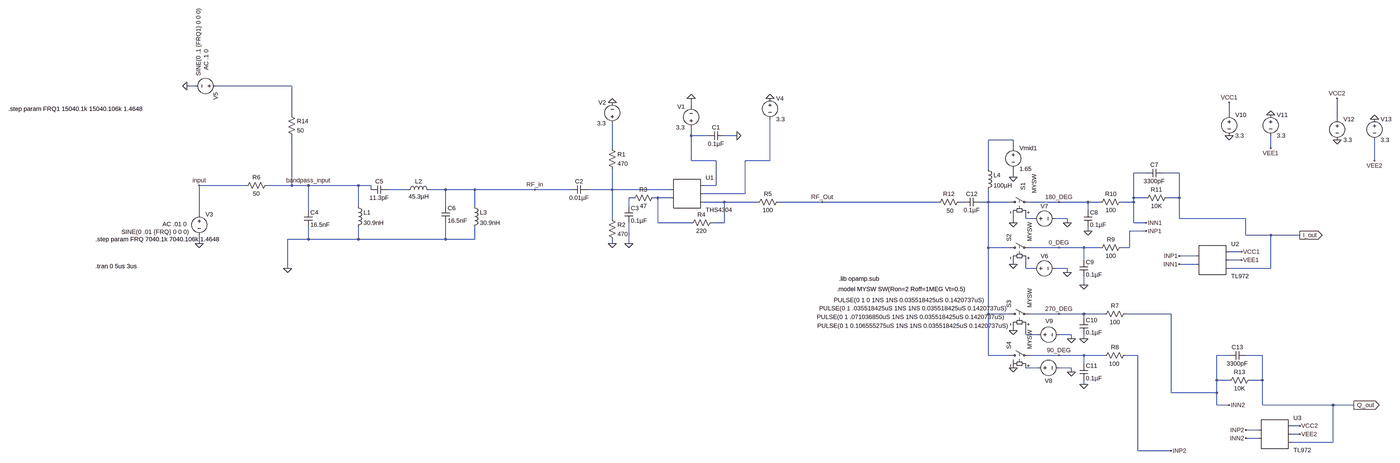
[diagram p0: schematic sdr20.asc, whole sheet]
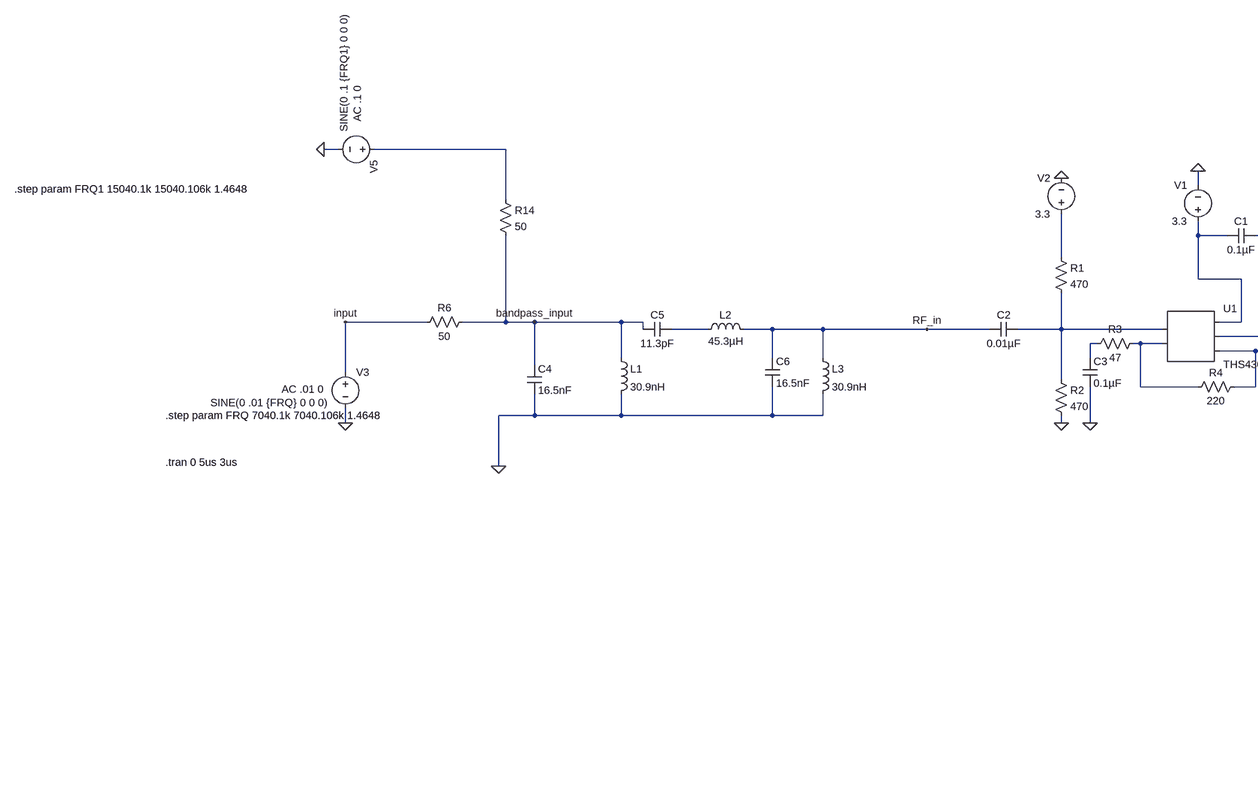
[diagram p1: schematic sdr20.asc, part, row 1 of 1, column 1 of 2]
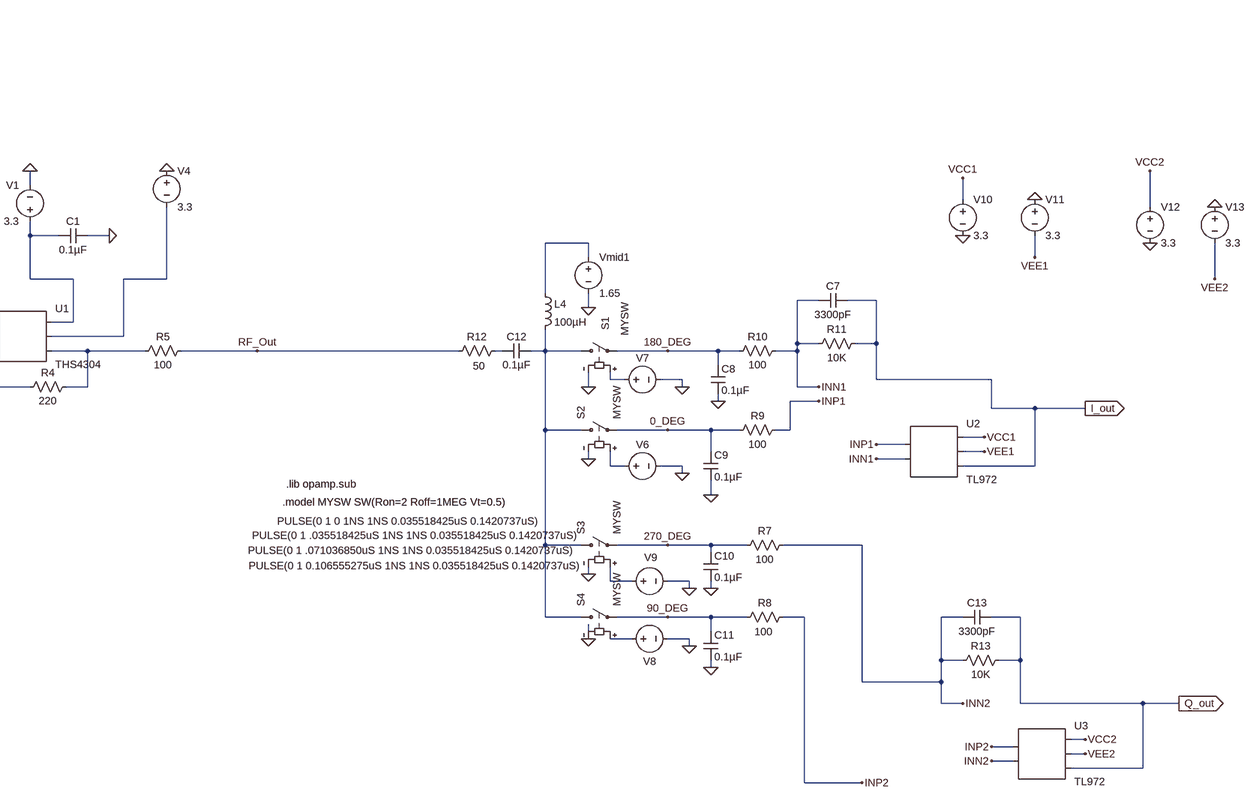
[diagram p2: schematic sdr20.asc, part, row 1 of 1, column 2 of 2]
sdr20.asc, the LTspice schematic file:
Version 4
SHEET 1 2920 1260
WIRE -1840 -208 -1872 -208
WIRE -1456 -208 -1760 -208
WIRE 208 -128 208 -160
WIRE -1456 -96 -1456 -208
WIRE 2288 -96 2288 -144
WIRE 2704 -80 2704 -160
WIRE 208 -16 208 -48
WIRE 272 -16 208 -16
WIRE 384 -16 336 -16
WIRE 1456 0 1360 0
WIRE -96 32 -96 -64
WIRE 1456 32 1456 0
WIRE 2448 32 2448 -16
WIRE 208 80 208 -16
WIRE 304 80 208 80
WIRE 512 80 512 -80
WIRE 512 80 416 80
WIRE 2848 80 2848 0
WIRE 1360 112 1360 0
WIRE 1968 128 1920 128
WIRE 2096 128 2032 128
WIRE 1456 144 1456 112
WIRE -1632 176 -1824 176
WIRE -1456 176 -1456 -16
WIRE -1456 176 -1552 176
WIRE -1392 176 -1456 176
WIRE -1184 176 -1392 176
WIRE -1136 176 -1184 176
WIRE 304 176 304 80
WIRE 304 176 256 176
WIRE -1136 192 -1136 176
WIRE -992 192 -1072 192
WIRE -848 192 -912 192
WIRE -736 192 -848 192
WIRE -496 192 -736 192
WIRE -256 192 -496 192
WIRE -96 192 -96 112
WIRE -96 192 -192 192
WIRE 128 192 -96 192
WIRE 416 208 416 80
WIRE 416 208 256 208
WIRE -16 224 -32 224
WIRE 80 224 64 224
WIRE 128 224 80 224
WIRE 1920 224 1920 128
WIRE 1968 224 1920 224
WIRE 2096 224 2096 128
WIRE 2096 224 2048 224
WIRE 336 240 256 240
WIRE 464 240 336 240
WIRE 720 240 544 240
WIRE 1168 240 720 240
WIRE 1264 240 1248 240
WIRE 1360 240 1360 192
WIRE 1360 240 1328 240
WIRE 1440 240 1360 240
WIRE 1632 240 1520 240
WIRE 1744 240 1632 240
WIRE 1792 240 1744 240
WIRE 1920 240 1920 224
WIRE 1920 240 1872 240
WIRE -1184 256 -1184 176
WIRE -848 256 -848 192
WIRE -736 256 -736 192
WIRE -32 256 -32 224
WIRE -1392 272 -1392 176
WIRE 1744 272 1744 240
WIRE -1824 288 -1824 176
WIRE -96 304 -96 192
WIRE 1504 304 1504 288
WIRE 1536 304 1504 304
WIRE 1664 304 1616 304
WIRE 2096 304 2096 224
WIRE 2352 304 2096 304
WIRE 80 320 80 224
WIRE 208 320 80 320
WIRE 336 320 336 240
WIRE 336 320 288 320
WIRE 1456 320 1456 288
WIRE 1664 320 1664 304
WIRE 1920 320 1920 240
WIRE 1968 320 1920 320
WIRE 1744 352 1744 336
WIRE 1968 352 1904 352
WIRE 2352 368 2352 304
WIRE 2448 368 2352 368
WIRE 2560 368 2448 368
WIRE -1392 384 -1392 336
WIRE -1392 384 -1472 384
WIRE -1184 384 -1184 336
WIRE -1184 384 -1392 384
WIRE -848 384 -848 320
WIRE -848 384 -1184 384
WIRE -736 384 -736 336
WIRE -736 384 -848 384
WIRE -1824 400 -1824 368
WIRE -96 400 -96 384
WIRE -32 400 -32 320
WIRE 1360 416 1360 240
WIRE 1440 416 1360 416
WIRE 1632 416 1520 416
WIRE 1728 416 1632 416
WIRE 1792 416 1728 416
WIRE 1904 416 1904 352
WIRE 1904 416 1872 416
WIRE 2336 432 2288 432
WIRE 2160 448 2096 448
WIRE 1728 464 1728 416
WIRE 2336 464 2288 464
WIRE 1456 480 1456 464
WIRE 2160 480 2096 480
WIRE -1472 496 -1472 384
WIRE 1504 496 1504 464
WIRE 1536 496 1504 496
WIRE 1664 496 1616 496
WIRE 2448 496 2448 368
WIRE 2448 496 2288 496
WIRE 1664 512 1664 496
WIRE 1728 560 1728 528
WIRE 1360 672 1360 416
WIRE 1440 672 1360 672
WIRE 1632 672 1520 672
WIRE 1728 672 1632 672
WIRE 1808 672 1728 672
WIRE 2064 672 1888 672
WIRE 1728 688 1728 672
WIRE 1456 736 1456 720
WIRE 1504 752 1504 720
WIRE 1552 752 1504 752
WIRE 1680 752 1632 752
WIRE 1680 768 1680 752
WIRE 1728 768 1728 752
WIRE 1360 832 1360 672
WIRE 1440 832 1360 832
WIRE 1632 832 1520 832
WIRE 1728 832 1632 832
WIRE 1808 832 1728 832
WIRE 1936 832 1888 832
WIRE 2288 832 2240 832
WIRE 2416 832 2352 832
WIRE 1456 864 1456 848
WIRE 1728 864 1728 832
WIRE 1552 880 1504 880
WIRE 1680 880 1632 880
WIRE 1680 896 1680 880
WIRE 2240 928 2240 832
WIRE 2288 928 2240 928
WIRE 2416 928 2416 832
WIRE 2416 928 2368 928
WIRE 1728 944 1728 928
WIRE 2064 976 2064 672
WIRE 2240 976 2240 928
WIRE 2240 976 2064 976
WIRE 2240 1024 2240 976
WIRE 2288 1024 2240 1024
WIRE 2416 1024 2416 928
WIRE 2688 1024 2416 1024
WIRE 2768 1024 2688 1024
WIRE 2560 1104 2528 1104
WIRE 2400 1120 2352 1120
WIRE 2560 1136 2528 1136
WIRE 2400 1152 2352 1152
WIRE 2688 1168 2688 1024
WIRE 2688 1168 2528 1168
WIRE 1936 1200 1936 832
WIRE 2064 1200 1936 1200
FLAG 208 -160 0
FLAG 384 -16 0
FLAG -96 400 0
FLAG -32 400 0
FLAG -1824 400 0
FLAG 720 240 RF_Out
FLAG -96 -144 0
FLAG 512 -160 0
FLAG -496 192 RF_in
FLAG -1472 496 0
FLAG 1632 416 0_DEG
FLAG 1632 240 180_DEG
FLAG 1632 832 90_DEG
FLAG 1632 672 270_DEG
FLAG 1456 320 0
FLAG 1456 480 0
FLAG 1456 736 0
FLAG 1456 880 0
FLAG 1664 320 0
FLAG 1664 512 0
FLAG 1680 768 0
FLAG 1680 896 0
FLAG 1744 352 0
FLAG 1728 560 0
FLAG 1728 768 0
FLAG 1728 944 0
FLAG 1456 144 0
FLAG 2560 368 I_out
IOPIN 2560 368 Out
FLAG 2768 1024 Q_out
IOPIN 2768 1024 Out
FLAG 2288 -16 0
FLAG 2448 -96 0
FLAG 1968 320 INN1
FLAG 2096 480 INN1
FLAG 1968 352 INP1
FLAG 2096 448 INP1
FLAG 2288 -144 VCC1
FLAG 2336 432 VCC1
FLAG 2448 32 VEE1
FLAG 2336 464 VEE1
FLAG 2288 1024 INN2
FLAG 2352 1152 INN2
FLAG 2352 1120 INP2
FLAG 2064 1200 INP2
FLAG 2704 0 0
FLAG 2848 -80 0
FLAG 2704 -160 VCC2
FLAG 2560 1104 VCC2
FLAG 2848 80 VEE2
FLAG 2560 1136 VEE2
FLAG -1824 176 input
FLAG -1872 -208 0
FLAG -1392 176 bandpass_input
SYMBOL AutoGenerated\\THS4304 192 208 R0
SYMATTR InstName U1
SYMBOL voltage 208 -32 R180
WINDOW 0 24 96 Left 2
WINDOW 3 24 16 Left 2
WINDOW 123 0 0 Left 0
WINDOW 39 0 0 Left 0
SYMATTR InstName V1
SYMATTR Value 3.3
SYMBOL cap 336 -32 R90
WINDOW 0 0 32 VBottom 2
WINDOW 3 32 32 VTop 2
SYMATTR InstName C1
SYMATTR Value 0.1µF
SYMBOL res -112 16 R0
SYMATTR InstName R1
SYMATTR Value 470
SYMBOL res -112 288 R0
SYMATTR InstName R2
SYMATTR Value 470
SYMBOL res 80 208 R90
WINDOW 0 0 56 VBottom 2
WINDOW 3 32 56 VTop 2
SYMATTR InstName R3
SYMATTR Value 47
SYMBOL res 304 304 R90
WINDOW 0 0 56 VBottom 2
WINDOW 3 32 56 VTop 2
SYMATTR InstName R4
SYMATTR Value 220
SYMBOL res 560 224 R90
WINDOW 0 0 56 VBottom 2
WINDOW 3 32 56 VTop 2
SYMATTR InstName R5
SYMATTR Value 100
SYMBOL cap -192 176 R90
WINDOW 0 0 32 VBottom 2
WINDOW 3 32 32 VTop 2
SYMATTR InstName C2
SYMATTR Value 0.01µF
SYMBOL cap -48 256 R0
SYMATTR InstName C3
SYMATTR Value 0.1µF
SYMBOL voltage -96 -48 R180
WINDOW 0 24 96 Left 2
WINDOW 3 24 16 Left 2
WINDOW 123 0 0 Left 0
WINDOW 39 0 0 Left 0
SYMATTR InstName V2
SYMATTR Value 3.3
SYMBOL voltage -1824 272 R0
WINDOW 123 -142 53 Left 2
WINDOW 39 0 0 Left 0
WINDOW 3 -300 83 Left 2
SYMATTR Value2 AC .01 0
SYMATTR Value SINE(0 .01 {FRQ} 0 0 0)
SYMATTR InstName V3
SYMBOL voltage 512 -176 R0
WINDOW 123 0 0 Left 0
WINDOW 39 0 0 Left 0
SYMATTR InstName V4
SYMATTR Value 3.3
SYMBOL res -1536 160 R90
WINDOW 0 0 56 VBottom 2
WINDOW 3 32 56 VTop 2
SYMATTR InstName R6
SYMATTR Value 50
SYMBOL cap -1408 272 R0
SYMATTR InstName C4
SYMATTR Value 16.5nF
SYMBOL ind -1200 240 R0
SYMATTR InstName L1
SYMATTR Value 30.9nH
SYMBOL cap -1072 176 R90
WINDOW 0 0 32 VBottom 2
WINDOW 3 32 32 VTop 2
SYMATTR InstName C5
SYMATTR Value 11.3pF
SYMBOL ind -1008 208 R270
WINDOW 0 32 56 VTop 2
WINDOW 3 5 56 VBottom 2
SYMATTR InstName L2
SYMATTR Value 45.3µH
SYMBOL cap -864 256 R0
SYMATTR InstName C6
SYMATTR Value 16.5nF
SYMBOL ind -752 240 R0
SYMATTR InstName L3
SYMATTR Value 30.9nH
SYMBOL res 1904 656 R90
WINDOW 0 0 56 VBottom 2
WINDOW 3 32 56 VTop 2
SYMATTR InstName R7
SYMATTR Value 100
SYMATTR SpiceLine tol=1
SYMBOL res 1904 816 R90
WINDOW 0 0 56 VBottom 2
WINDOW 3 33 59 VTop 2
SYMATTR InstName R8
SYMATTR Value 100
SYMATTR SpiceLine tol=1
SYMBOL res 1888 400 R90
WINDOW 0 0 56 VBottom 2
WINDOW 3 32 56 VTop 2
SYMATTR InstName R9
SYMATTR Value 100
SYMATTR SpiceLine tol=1
SYMBOL res 1888 224 R90
WINDOW 0 0 56 VBottom 2
WINDOW 3 32 56 VTop 2
SYMATTR InstName R10
SYMATTR Value 100
SYMATTR SpiceLine tol=1]
SYMBOL cap 2032 112 R90
WINDOW 0 0 32 VBottom 2
WINDOW 3 32 32 VTop 2
SYMATTR InstName C7
SYMATTR Value 3300pF
SYMBOL cap 1728 272 R0
SYMATTR InstName C8
SYMATTR Value 0.1µF
SYMBOL cap 1712 464 R0
SYMATTR InstName C9
SYMATTR Value 0.1µF
SYMBOL cap 1712 688 R0
SYMATTR InstName C10
SYMATTR Value 0.1µF
SYMBOL cap 1712 864 R0
SYMATTR InstName C11
SYMATTR Value 0.1µF
SYMBOL res 2064 208 R90
WINDOW 0 0 56 VBottom 2
WINDOW 3 32 56 VTop 2
SYMATTR InstName R11
SYMATTR Value 10K
SYMATTR SpiceLine tol=1
SYMBOL sw 1424 240 R270
WINDOW 3 34 113 Left 2
WINDOW 0 46 70 Left 2
SYMATTR Value MYSW
SYMATTR InstName S1
SYMBOL sw 1424 416 R270
SYMATTR InstName S2
SYMATTR Value MYSW
SYMBOL sw 1424 672 R270
SYMATTR InstName S3
SYMATTR Value MYSW
SYMBOL sw 1424 832 R270
SYMATTR InstName S4
SYMATTR Value MYSW
SYMBOL voltage 1520 496 R270
WINDOW 0 32 56 VTop 2
WINDOW 3 -107 -464 VBottom 2
WINDOW 123 0 0 Left 0
WINDOW 39 0 0 Left 0
SYMATTR InstName V6
SYMATTR Value PULSE(0 1 0 1NS 1NS 0.035518425uS 0.1420737uS)
SYMBOL voltage 1520 304 R270
WINDOW 0 32 56 VTop 2
WINDOW 3 -364 -457 VBottom 2
WINDOW 123 0 0 Left 0
WINDOW 39 0 0 Left 0
SYMATTR InstName V7
SYMATTR Value PULSE(0 1 .071036850uS 1NS 1NS 0.035518425uS 0.1420737uS)
SYMBOL voltage 1536 880 R270
WINDOW 0 -66 56 VTop 2
WINDOW 3 245 -464 VBottom 2
WINDOW 123 0 0 Left 0
WINDOW 39 0 0 Left 0
SYMATTR InstName V8
SYMATTR Value PULSE(0 1 .035518425uS 1NS 1NS 0.035518425uS 0.1420737uS)
SYMBOL voltage 1536 752 R270
WINDOW 0 37 59 VTop 2
WINDOW 3 50 -465 VBottom 2
WINDOW 123 0 0 Left 0
WINDOW 39 0 0 Left 0
SYMATTR InstName V9
SYMATTR Value PULSE(0 1 0.106555275uS 1NS 1NS 0.035518425uS 0.1420737uS)
SYMBOL res 1264 224 R90
WINDOW 0 0 56 VBottom 2
WINDOW 3 34 51 VTop 2
SYMATTR InstName R12
SYMATTR Value 50
SYMBOL ind 1344 96 R0
SYMATTR InstName L4
SYMATTR Value 100µH
SYMBOL cap 1328 224 R90
WINDOW 0 0 32 VBottom 2
WINDOW 3 32 32 VTop 2
SYMATTR InstName C12
SYMATTR Value 0.1µF
SYMBOL cap 2352 816 R90
WINDOW 0 0 32 VBottom 2
WINDOW 3 32 32 VTop 2
SYMATTR InstName C13
SYMATTR Value 3300pF
SYMBOL res 2384 912 R90
WINDOW 0 0 56 VBottom 2
WINDOW 3 32 56 VTop 2
SYMATTR InstName R13
SYMATTR Value 10K
SYMATTR SpiceLine tol=1
SYMBOL voltage 1456 16 R0
SYMATTR InstName Vmid1
SYMATTR Value 1.65
SYMATTR SpiceLine Rser=10
SYMBOL AutoGenerated\\TL972 2224 464 R0
SYMATTR InstName U2
SYMBOL AutoGenerated\\TL972 2464 1136 R0
SYMATTR InstName U3
SYMBOL voltage 2288 -112 R0
WINDOW 123 0 0 Left 0
WINDOW 39 0 0 Left 0
SYMATTR InstName V10
SYMATTR Value 3.3
SYMBOL voltage 2448 -112 R0
WINDOW 123 0 0 Left 0
WINDOW 39 0 0 Left 0
SYMATTR InstName V11
SYMATTR Value 3.3
SYMBOL voltage 2704 -96 R0
WINDOW 123 0 0 Left 0
WINDOW 39 0 0 Left 0
SYMATTR InstName V12
SYMATTR Value 3.3
SYMBOL voltage 2848 -96 R0
WINDOW 123 0 0 Left 0
WINDOW 39 0 0 Left 0
SYMATTR InstName V13
SYMATTR Value 3.3
SYMBOL voltage -1744 -208 R90
WINDOW 123 -142 53 Left 2
WINDOW 39 0 0 Left 0
WINDOW 3 -300 83 Left 2
SYMATTR Value2 AC .1 0
SYMATTR Value SINE(0 .1 {FRQ1} 0 0 0)
SYMATTR InstName V5
SYMBOL res -1472 -112 R0
SYMATTR InstName R14
SYMATTR Value 50
TEXT -2224 384 Left 2 !.step param FRQ 7040.1k 7040.106k 1.4648
TEXT -2224 488 Left 2 !.tran 0 5us 3us
TEXT 776 576 Left 2 !.model MYSW SW(Ron=2 Roff=1MEG Vt=0.5)
TEXT 784 536 Left 2 !.lib opamp.sub
TEXT -2560 -120 Left 2 !.step param FRQ1 15040.1k 15040.106k 1.4648

The netlist it stands for:
* sdr20.asc
* U1: THS4304 (symbol AutoGenerated\THS4304 not available, pins judged from their places): pin1=N007 pin2=N009 pin3=N002 pin4=N005 pin5=N010
V1 N002 0 3.3
C1 0 N002 0.1µF
R1 N004 N007 470
R2 N007 0 470
R3 N009 N008 47
R4 N010 N009 220
R5 RF_Out N010 100
C2 N007 RF_in 0.01µF
C3 N008 0 0.1µF
V2 N004 0 3.3
V3 input 0 SINE(0 .01 {FRQ} 0 0 0) AC .01 0
V4 0 N005 3.3
R6 bandpass_input input 50
C4 bandpass_input 0 16.5nF
L1 bandpass_input 0 30.9nH
C5 N006 bandpass_input 11.3pF
L2 N006 RF_in 45.3µH
C6 RF_in 0 16.5nF
L3 RF_in 0 30.9nH
R7 INN2 270_DEG 100 tol=1
R8 INP2 90_DEG 100 tol=1
R9 INP1 0_DEG 100 tol=1
R10 INN1 180_DEG 100 tol=1]
C7 I_out INN1 3300pF
C8 180_DEG 0 0.1µF
C9 0_DEG 0 0.1µF
C10 270_DEG 0 0.1µF
C11 90_DEG 0 0.1µF
R11 I_out INN1 10K tol=1
S1 N012 180_DEG N013 0 MYSW
S2 N012 0_DEG N014 0 MYSW
S3 N012 270_DEG N015 0 MYSW
S4 N012 90_DEG N017 0 MYSW
V6 N014 0 PULSE(0 1 0 1NS 1NS 0.035518425uS 0.1420737uS)
V7 N013 0 PULSE(0 1 .071036850uS 1NS 1NS 0.035518425uS 0.1420737uS)
V8 N017 0 PULSE(0 1 .035518425uS 1NS 1NS 0.035518425uS 0.1420737uS)
V9 N015 0 PULSE(0 1 0.106555275uS 1NS 1NS 0.035518425uS 0.1420737uS)
R12 N011 RF_Out 50
L4 N003 N012 100µH
C12 N012 N011 0.1µF
C13 Q_out INN2 3300pF
R13 Q_out INN2 10K tol=1
Vmid1 N003 0 1.65 Rser=10
* U2: TL972 (symbol AutoGenerated\TL972 not available, pins judged from their places): pin1=INP1 pin2=INN1 pin3=VCC1 pin4=VEE1 pin5=I_out
* U3: TL972 (symbol AutoGenerated\TL972 not available, pins judged from their places): pin1=INP2 pin2=INN2 pin3=VCC2 pin4=VEE2 pin5=Q_out
V10 VCC1 0 3.3
V11 0 VEE1 3.3
V12 VCC2 0 3.3
V13 0 VEE2 3.3
V5 N001 0 SINE(0 .1 {FRQ1} 0 0 0) AC .1 0
R14 N001 bandpass_input 50
.step param FRQ 7040.1k 7040.106k 1.4648
.tran 0 5us 3us
.model MYSW SW(Ron=2 Roff=1MEG Vt=0.5)
.lib opamp.sub
.step param FRQ1 15040.1k 15040.106k 1.4648
.backanno
.end